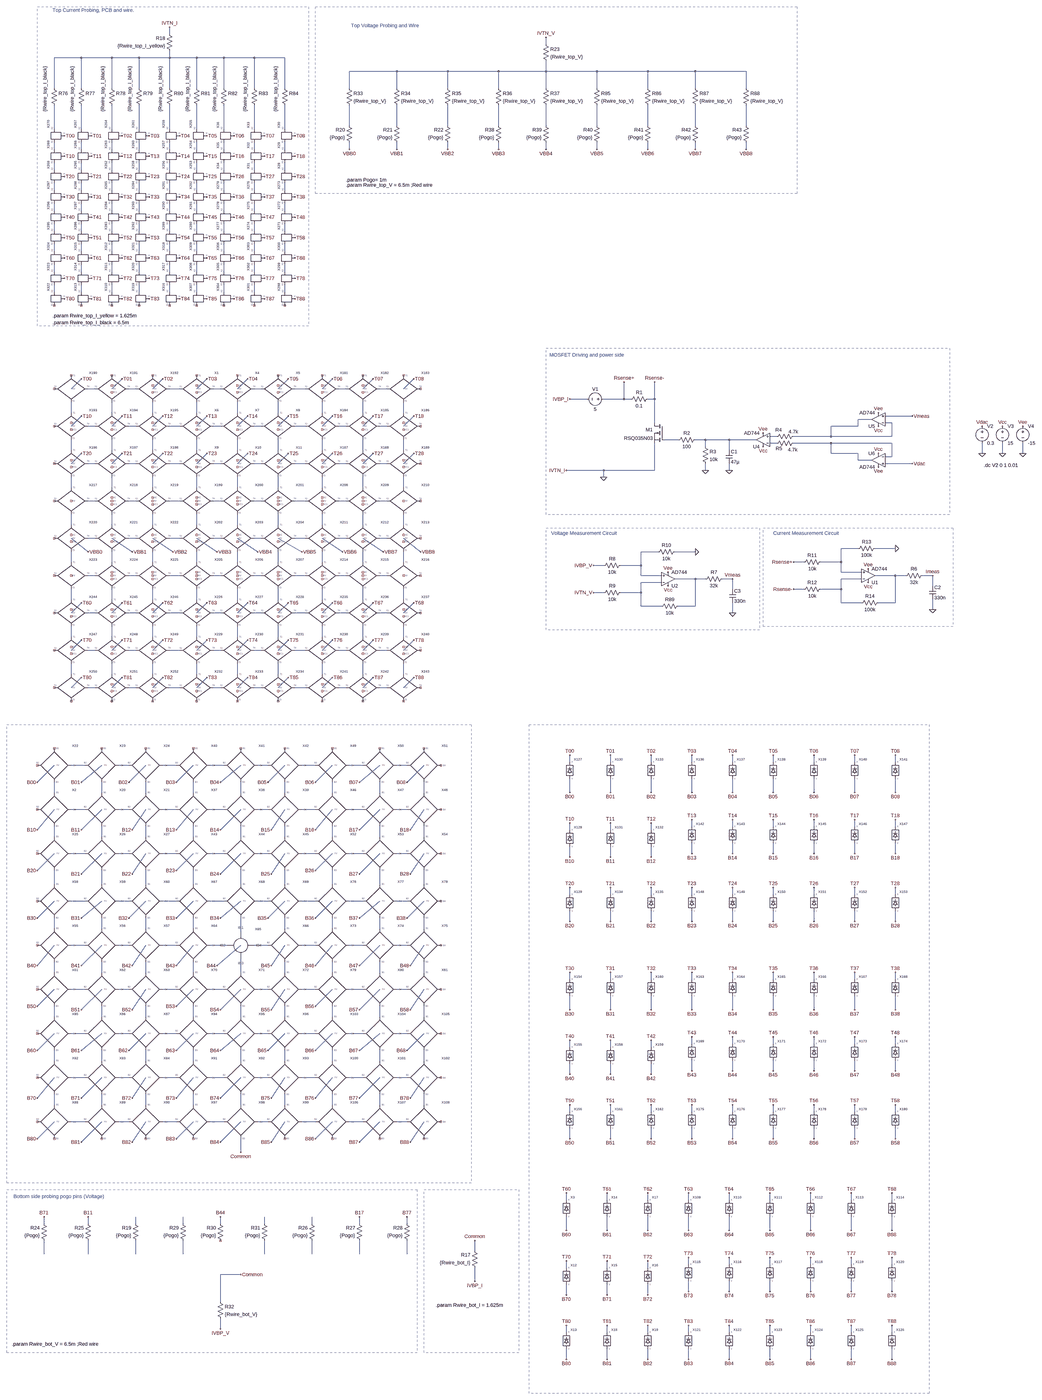
[diagram p0: schematic IVProbingV2_9x9.asc, whole sheet]
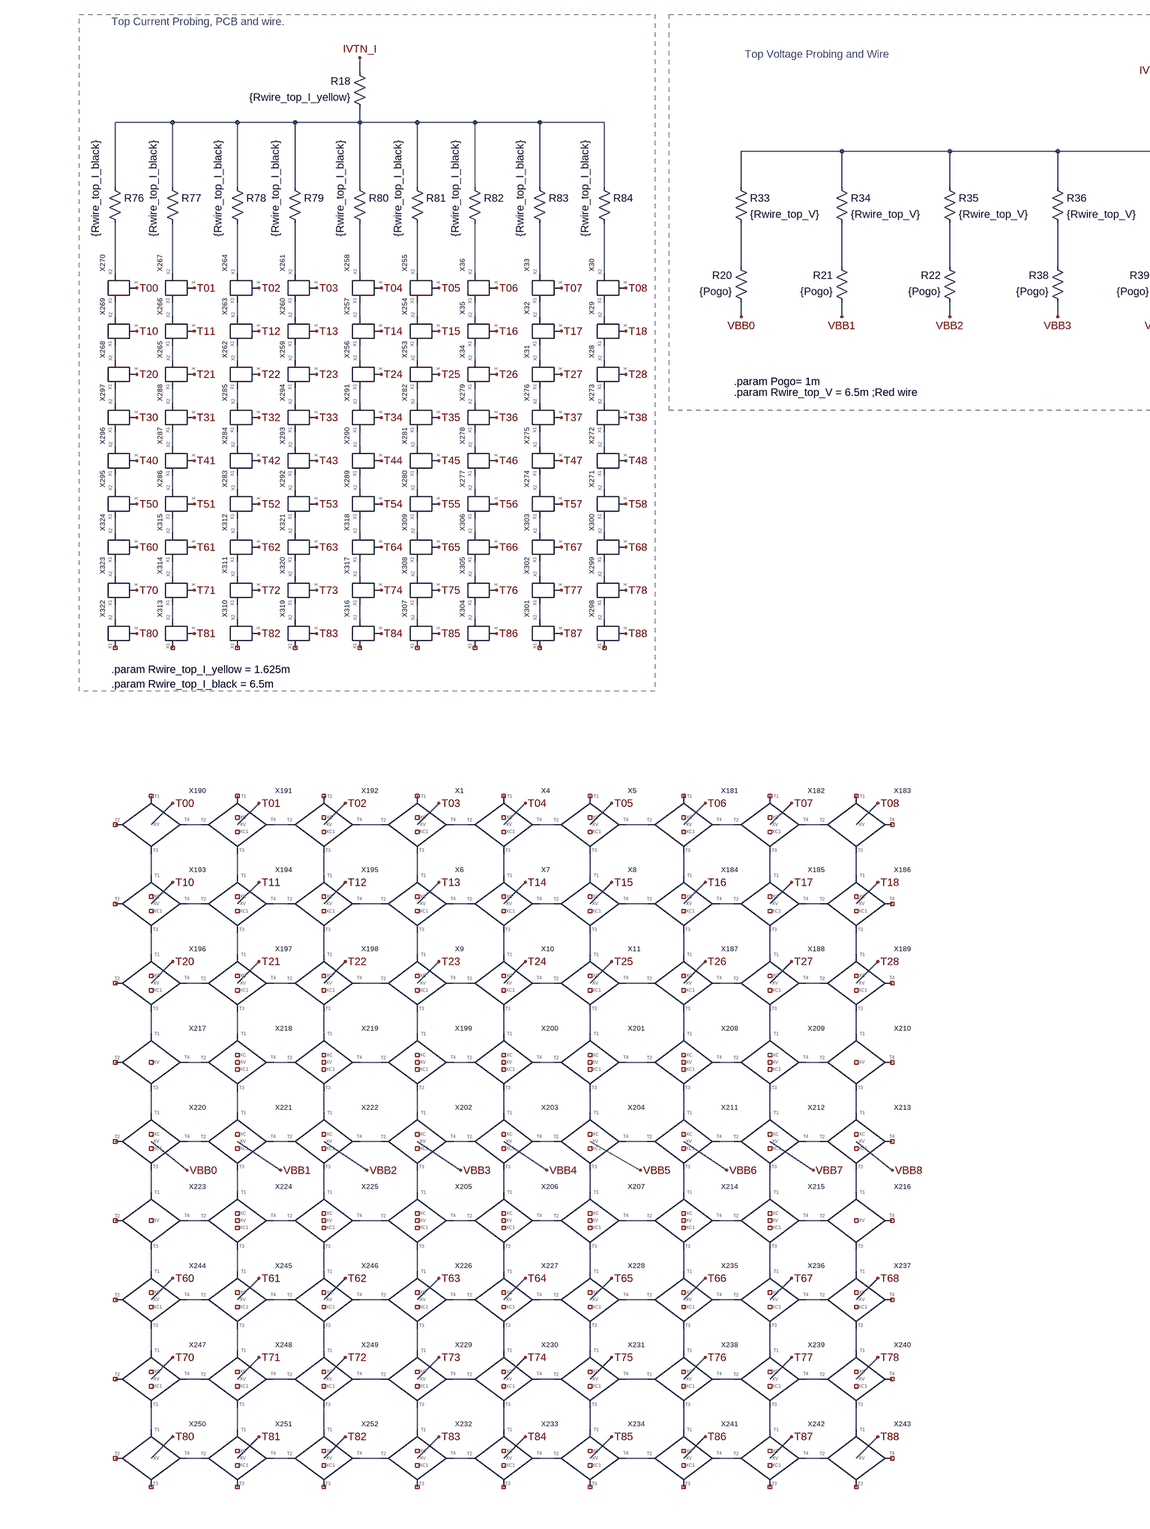
[diagram p1: schematic IVProbingV2_9x9.asc, part, row 1 of 2, column 1 of 2]
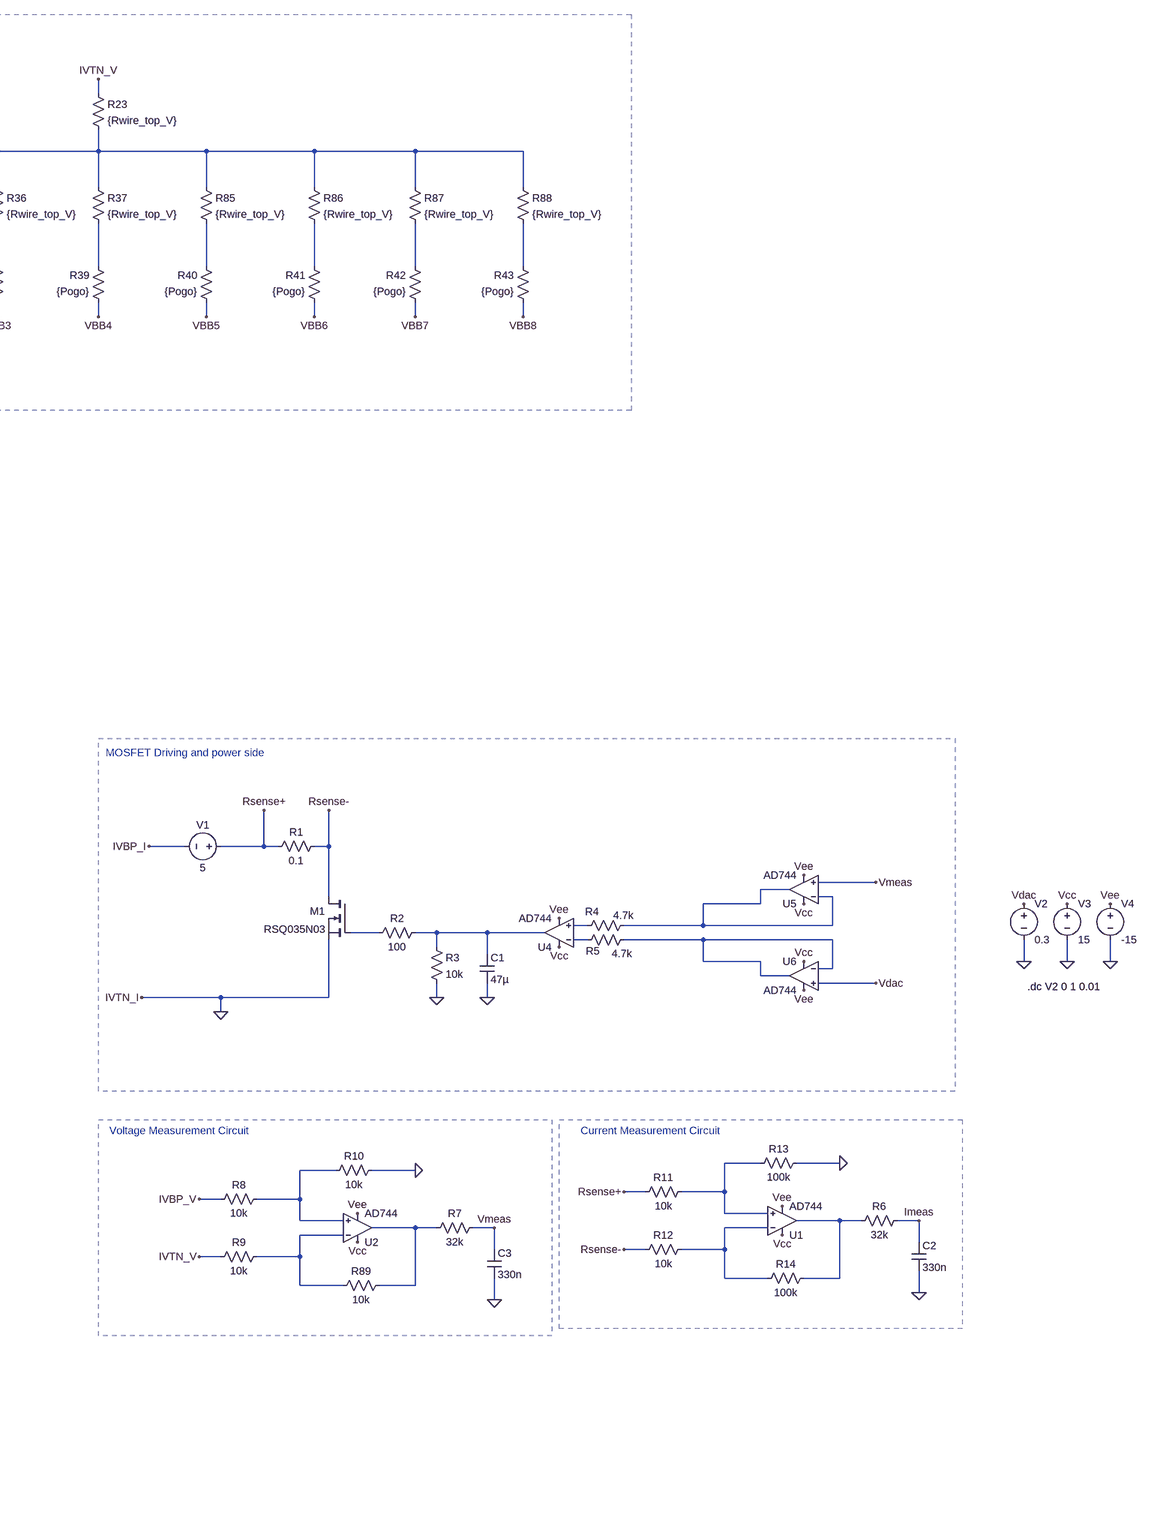
[diagram p2: schematic IVProbingV2_9x9.asc, part, row 1 of 2, column 2 of 2]
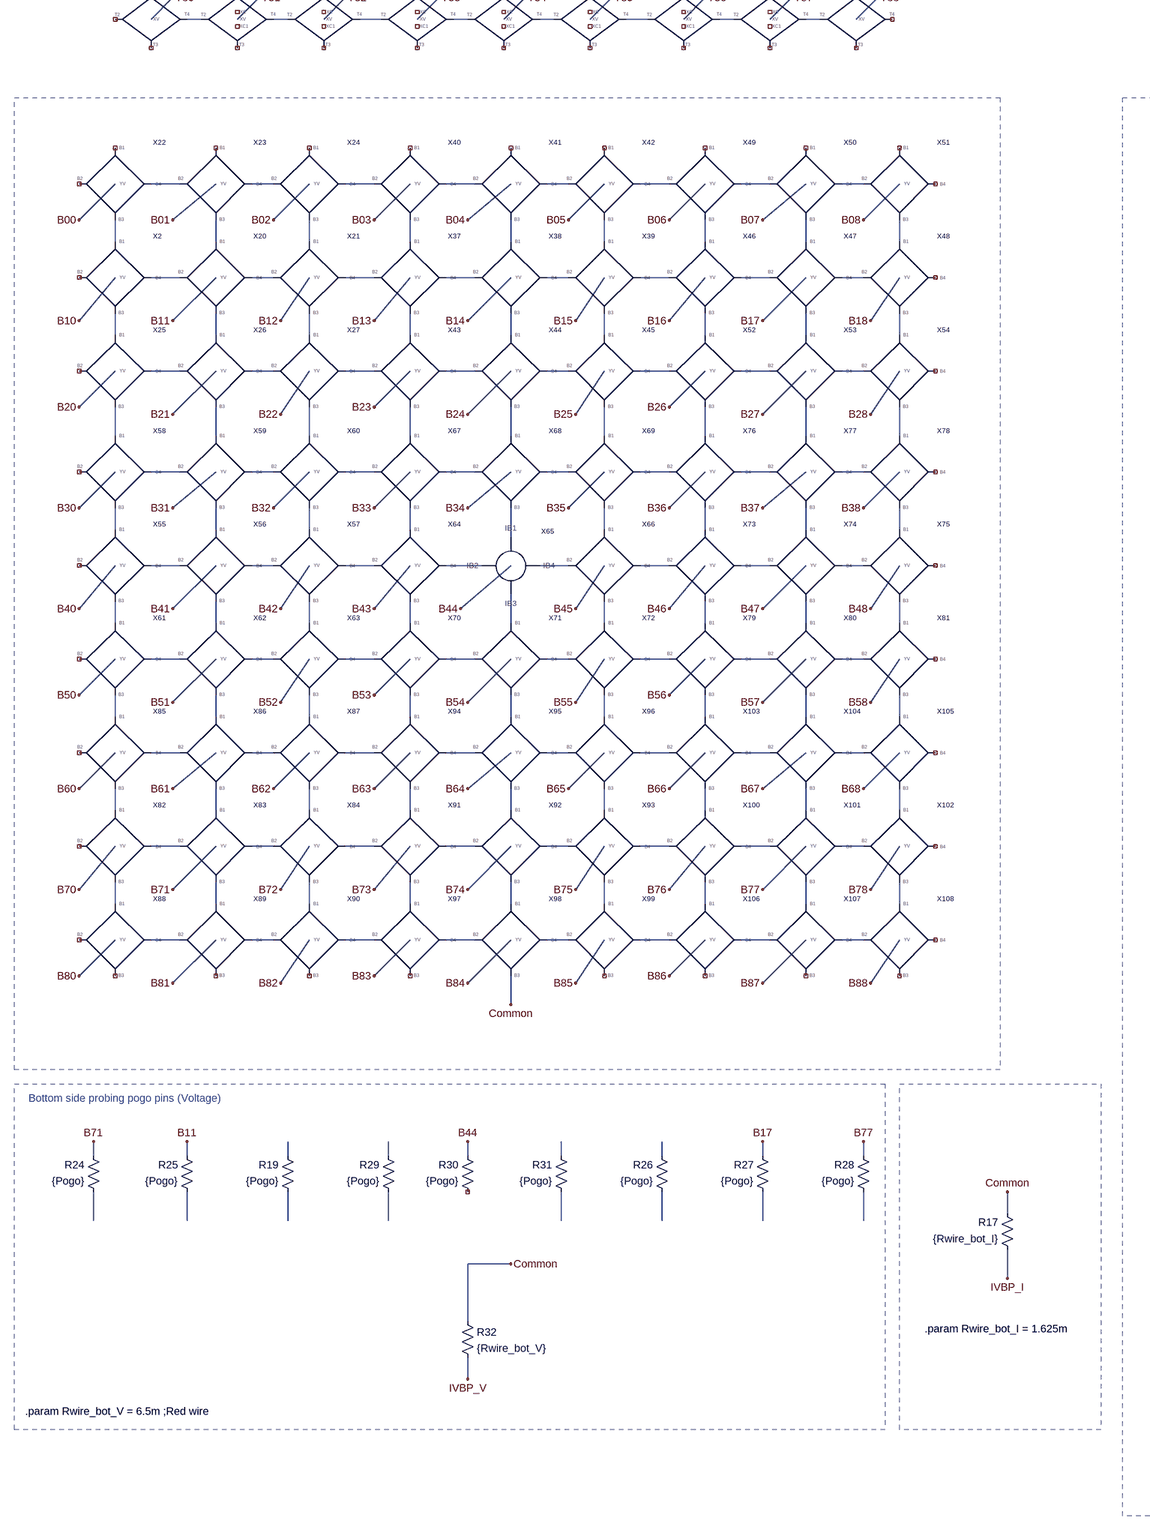
[diagram p3: schematic IVProbingV2_9x9.asc, part, row 2 of 2, column 1 of 2]
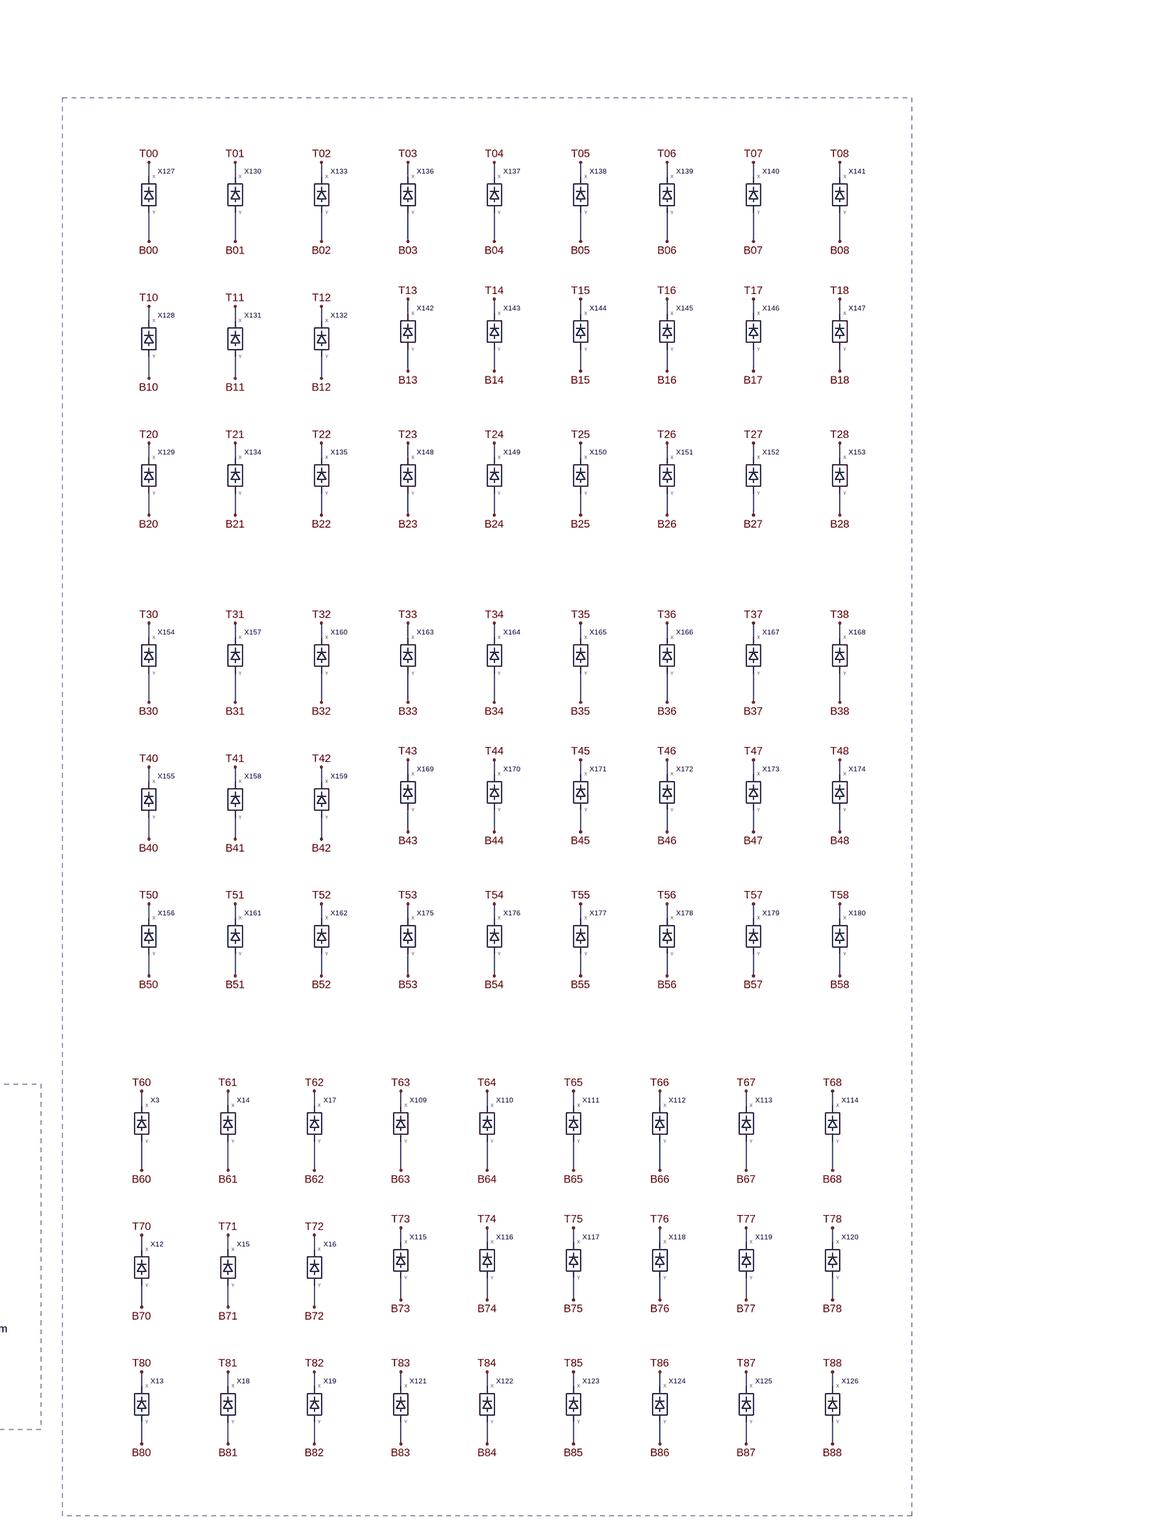
[diagram p4: schematic IVProbingV2_9x9.asc, part, row 2 of 2, column 2 of 2]
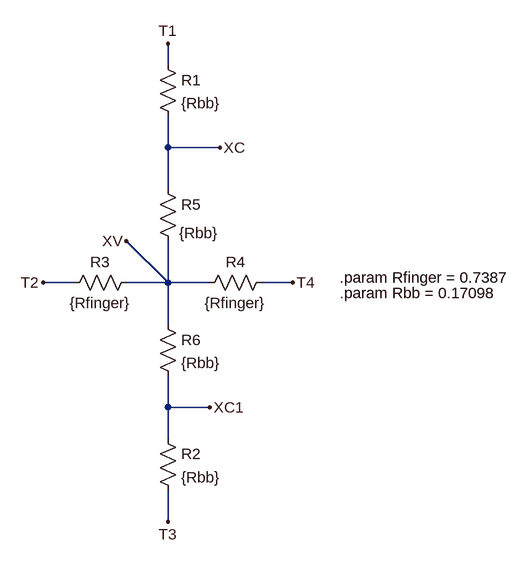
[diagram p5: sub-circuit ivtopelement.asc]
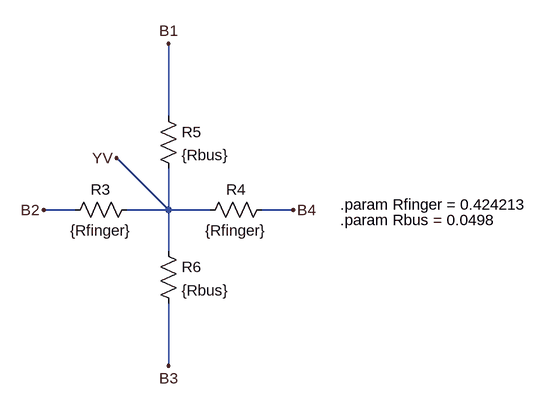
[diagram p6: sub-circuit ivbottomelement.asc]
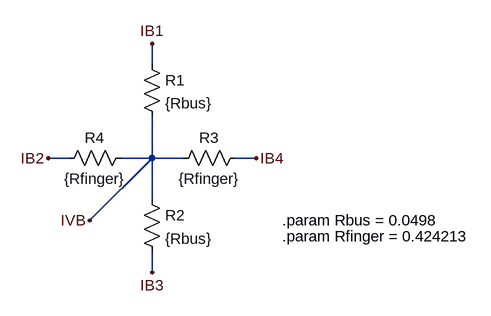
[diagram p7: sub-circuit ivbottomelementiso.asc]
* IVProbingV2_9x9.asc
XX1 T03 NC_01 NC_02 NC_03 N095 N104 N096 ivtopelement
XX2 N257 NC_04 N274 N266 B10 ivbottomelement
XX3 T60 B60 IVCellModel  ; pins X Y
R1 Rsense- Rsense+ 0.1
V1 Rsense+ IVBP_I 5
R2 N121 N120 100
R3 N121 0 10k
C1 N121 0 47µ
R4 N110 N119 4.7k
R5 N123 N122 4.7k
V2 Vdac 0 0.3
V3 Vcc 0 15
V4 Vee 0 -15
R6 Imeas N194 32k
C2 Imeas 0 330n
R11 N175 Rsense+ 10k
R12 N196 Rsense- 10k
R13 0 N175 100k
R14 N194 N196 100k
XU1 N175 N196 Vcc Vee N194 AD744  ; pins In+ In- V+ V- OUT
XU4 N119 N122 Vcc Vee N121 AD744  ; pins In+ In- V+ V- OUT
XU5 Vmeas N110 Vcc Vee N110 AD744  ; pins In+ In- V+ V- OUT
XU6 Vdac N123 Vcc Vee N123 AD744  ; pins In+ In- V+ V- OUT
XX4 T04 NC_05 NC_06 NC_07 N096 N105 N097 ivtopelement
XX5 T05 NC_08 NC_09 NC_10 N097 N106 N098 ivtopelement
XX6 T13 NC_11 NC_12 N104 N113 N127 N114 ivtopelement
XX7 T14 NC_13 NC_14 N105 N114 N128 N115 ivtopelement
XX8 T15 NC_15 NC_16 N106 N115 N129 N116 ivtopelement
XX9 T23 NC_17 NC_18 N127 N135 N144 N136 ivtopelement
XX10 T24 NC_19 NC_20 N128 N136 N145 N137 ivtopelement
XX11 T25 NC_21 NC_22 N129 N137 N146 N138 ivtopelement
XX12 T70 B70 IVCellModel  ; pins X Y
XX13 T80 B80 IVCellModel  ; pins X Y
XX14 T61 B61 IVCellModel  ; pins X Y
XX15 T71 B71 IVCellModel  ; pins X Y
XX16 T72 B72 IVCellModel  ; pins X Y
XX17 T62 B62 IVCellModel  ; pins X Y
XX18 T81 B81 IVCellModel  ; pins X Y
XX19 T82 B82 IVCellModel  ; pins X Y
XX20 N258 N266 N275 N267 B11 ivbottomelement
XX21 N259 N267 N276 N268 B12 ivbottomelement
XX22 NC_23 NC_24 N257 N249 B00 ivbottomelement
XX23 NC_25 N249 N258 N250 B01 ivbottomelement
XX24 NC_26 N250 N259 N251 B02 ivbottomelement
XX25 N274 NC_27 N291 N283 B20 ivbottomelement
XX26 N275 N283 N292 N284 B21 ivbottomelement
XX27 N276 N284 N293 N285 B22 ivbottomelement
R17 IVBP_I Common {Rwire_bot_I}
XX28 T28 N047 N038 IVProbingPCB  ; pins X X1 X2
XX29 T18 N038 N029 IVProbingPCB  ; pins X X1 X2
XX30 T08 N029 N020 IVProbingPCB  ; pins X X1 X2
XX31 T27 N046 N037 IVProbingPCB  ; pins X X1 X2
XX32 T17 N037 N028 IVProbingPCB  ; pins X X1 X2
XX33 T07 N028 N019 IVProbingPCB  ; pins X X1 X2
XX34 T26 N045 N036 IVProbingPCB  ; pins X X1 X2
XX35 T16 N036 N027 IVProbingPCB  ; pins X X1 X2
XX36 T06 N027 N018 IVProbingPCB  ; pins X X1 X2
R18 N001 0 {Rwire_top_I_yellow}
R19 N399 N393 {Pogo}
R20 VBB0 N003 {Pogo}
R21 VBB1 N004 {Pogo}
R22 VBB2 N005 {Pogo}
R23 IVTN_V N002 {Rwire_top_V}
R24 N397 B71 {Pogo}
R25 N398 B11 {Pogo}
R26 N402 N396 {Pogo}
R27 N403 B17 {Pogo}
R28 N404 B77 {Pogo}
R29 N400 N394 {Pogo}
R30 NC_28 B44 {Pogo}
R31 N401 N395 {Pogo}
R32 Common IVBP_V {Rwire_bot_V}
XX37 N260 N268 N277 N269 B13 ivbottomelement
XX38 N261 N269 N278 N270 B14 ivbottomelement
XX39 N262 N270 N279 N271 B15 ivbottomelement
XX40 NC_29 N251 N260 N252 B03 ivbottomelement
XX41 NC_30 N252 N261 N253 B04 ivbottomelement
XX42 NC_31 N253 N262 N254 B05 ivbottomelement
XX43 N277 N285 N294 N286 B23 ivbottomelement
XX44 N278 N286 N295 N287 B24 ivbottomelement
XX45 N279 N287 N296 N288 B25 ivbottomelement
XX46 N263 N271 N280 N272 B16 ivbottomelement
XX47 N264 N272 N281 N273 B17 ivbottomelement
XX48 N265 N273 N282 NC_32 B18 ivbottomelement
XX49 NC_33 N254 N263 N255 B06 ivbottomelement
XX50 NC_34 N255 N264 N256 B07 ivbottomelement
XX51 NC_35 N256 N265 NC_36 B08 ivbottomelement
XX52 N280 N288 N297 N289 B26 ivbottomelement
XX53 N281 N289 N298 N290 B27 ivbottomelement
XX54 N282 N290 N299 NC_37 B28 ivbottomelement
XX55 N308 NC_38 N325 N317 B40 ivbottomelement
XX56 N309 N317 N326 N318 B41 ivbottomelement
XX57 N310 N318 N327 N319 B42 ivbottomelement
XX58 N291 NC_39 N308 N300 B30 ivbottomelement
XX59 N292 N300 N309 N301 B31 ivbottomelement
XX60 N293 N301 N310 N302 B32 ivbottomelement
XX61 N325 NC_40 N342 N334 B50 ivbottomelement
XX62 N326 N334 N343 N335 B51 ivbottomelement
XX63 N327 N335 N344 N336 B52 ivbottomelement
XX64 N311 N319 N328 N320 B43 ivbottomelement
XX66 N312 N321 N330 N322 B45 ivbottomelement
XX67 N294 N302 N311 N303 B33 ivbottomelement
XX68 N295 N303 N316 N304 B34 ivbottomelement
XX69 N296 N304 N312 N305 B35 ivbottomelement
XX70 N328 N336 N345 N337 B53 ivbottomelement
XX71 N329 N337 N346 N338 B54 ivbottomelement
XX72 N330 N338 N347 N339 B55 ivbottomelement
XX73 N313 N322 N331 N323 B46 ivbottomelement
XX74 N314 N323 N332 N324 B47 ivbottomelement
XX75 N315 N324 N333 NC_41 B48 ivbottomelement
XX76 N297 N305 N313 N306 B36 ivbottomelement
XX77 N298 N306 N314 N307 B37 ivbottomelement
XX78 N299 N307 N315 NC_42 B38 ivbottomelement
XX79 N331 N339 N348 N340 B56 ivbottomelement
XX80 N332 N340 N349 N341 B57 ivbottomelement
XX81 N333 N341 N350 NC_43 B58 ivbottomelement
XX82 N359 NC_44 N376 N368 B70 ivbottomelement
XX83 N360 N368 N377 N369 B71 ivbottomelement
XX84 N361 N369 N378 N370 B72 ivbottomelement
XX85 N342 NC_45 N359 N351 B60 ivbottomelement
XX86 N343 N351 N360 N352 B61 ivbottomelement
XX87 N344 N352 N361 N353 B62 ivbottomelement
XX88 N376 NC_46 NC_47 N385 B80 ivbottomelement
XX89 N377 N385 NC_48 N386 B81 ivbottomelement
XX90 N378 N386 NC_49 N387 B82 ivbottomelement
XX91 N362 N370 N379 N371 B73 ivbottomelement
XX92 N363 N371 N380 N372 B74 ivbottomelement
XX93 N364 N372 N381 N373 B75 ivbottomelement
XX94 N345 N353 N362 N354 B63 ivbottomelement
XX95 N346 N354 N363 N355 B64 ivbottomelement
XX96 N347 N355 N364 N356 B65 ivbottomelement
XX97 N379 N387 NC_50 N388 B83 ivbottomelement
XX98 N380 N388 Common N389 B84 ivbottomelement
XX99 N381 N389 NC_51 N390 B85 ivbottomelement
XX100 N365 N373 N382 N374 B76 ivbottomelement
XX101 N366 N374 N383 N375 B77 ivbottomelement
XX102 N367 N375 N384 NC_52 B78 ivbottomelement
XX103 N348 N356 N365 N357 B66 ivbottomelement
XX104 N349 N357 N366 N358 B67 ivbottomelement
XX105 N350 N358 N367 NC_53 B68 ivbottomelement
XX106 N382 N390 NC_54 N391 B86 ivbottomelement
XX107 N383 N391 NC_55 N392 B87 ivbottomelement
XX108 N384 N392 NC_56 NC_57 B88 ivbottomelement
XX109 T63 B63 IVCellModel  ; pins X Y
XX110 T64 B64 IVCellModel  ; pins X Y
XX111 T65 B65 IVCellModel  ; pins X Y
XX112 T66 B66 IVCellModel  ; pins X Y
XX113 T67 B67 IVCellModel  ; pins X Y
XX114 T68 B68 IVCellModel  ; pins X Y
XX115 T73 B73 IVCellModel  ; pins X Y
XX116 T74 B74 IVCellModel  ; pins X Y
XX117 T75 B75 IVCellModel  ; pins X Y
XX118 T76 B76 IVCellModel  ; pins X Y
XX119 T77 B77 IVCellModel  ; pins X Y
XX120 T78 B78 IVCellModel  ; pins X Y
XX121 T83 B83 IVCellModel  ; pins X Y
XX122 T84 B84 IVCellModel  ; pins X Y
XX123 T85 B85 IVCellModel  ; pins X Y
XX124 T86 B86 IVCellModel  ; pins X Y
XX125 T87 B87 IVCellModel  ; pins X Y
XX126 T88 B88 IVCellModel  ; pins X Y
XX127 T00 B00 IVCellModel  ; pins X Y
XX128 T10 B10 IVCellModel  ; pins X Y
XX129 T20 B20 IVCellModel  ; pins X Y
XX130 T01 B01 IVCellModel  ; pins X Y
XX131 T11 B11 IVCellModel  ; pins X Y
XX132 T12 B12 IVCellModel  ; pins X Y
XX133 T02 B02 IVCellModel  ; pins X Y
XX134 T21 B21 IVCellModel  ; pins X Y
XX135 T22 B22 IVCellModel  ; pins X Y
XX136 T03 B03 IVCellModel  ; pins X Y
XX137 T04 B04 IVCellModel  ; pins X Y
XX138 T05 B05 IVCellModel  ; pins X Y
XX139 T06 B06 IVCellModel  ; pins X Y
XX140 T07 B07 IVCellModel  ; pins X Y
XX141 T08 B08 IVCellModel  ; pins X Y
XX142 T13 B13 IVCellModel  ; pins X Y
XX143 T14 B14 IVCellModel  ; pins X Y
XX144 T15 B15 IVCellModel  ; pins X Y
XX145 T16 B16 IVCellModel  ; pins X Y
XX146 T17 B17 IVCellModel  ; pins X Y
XX147 T18 B18 IVCellModel  ; pins X Y
XX148 T23 B23 IVCellModel  ; pins X Y
XX149 T24 B24 IVCellModel  ; pins X Y
XX150 T25 B25 IVCellModel  ; pins X Y
XX151 T26 B26 IVCellModel  ; pins X Y
XX152 T27 B27 IVCellModel  ; pins X Y
XX153 T28 B28 IVCellModel  ; pins X Y
XX154 T30 B30 IVCellModel  ; pins X Y
XX155 T40 B40 IVCellModel  ; pins X Y
XX156 T50 B50 IVCellModel  ; pins X Y
XX157 T31 B31 IVCellModel  ; pins X Y
XX158 T41 B41 IVCellModel  ; pins X Y
XX159 T42 B42 IVCellModel  ; pins X Y
XX160 T32 B32 IVCellModel  ; pins X Y
XX161 T51 B51 IVCellModel  ; pins X Y
XX162 T52 B52 IVCellModel  ; pins X Y
XX163 T33 B33 IVCellModel  ; pins X Y
XX164 T34 B34 IVCellModel  ; pins X Y
XX165 T35 B35 IVCellModel  ; pins X Y
XX166 T36 B36 IVCellModel  ; pins X Y
XX167 T37 B37 IVCellModel  ; pins X Y
XX168 T38 B38 IVCellModel  ; pins X Y
XX169 T43 B43 IVCellModel  ; pins X Y
XX170 T44 B44 IVCellModel  ; pins X Y
XX171 T45 B45 IVCellModel  ; pins X Y
XX172 T46 B46 IVCellModel  ; pins X Y
XX173 T47 B47 IVCellModel  ; pins X Y
XX174 T48 B48 IVCellModel  ; pins X Y
XX175 T53 B53 IVCellModel  ; pins X Y
XX176 T54 B54 IVCellModel  ; pins X Y
XX177 T55 B55 IVCellModel  ; pins X Y
XX178 T56 B56 IVCellModel  ; pins X Y
XX179 T57 B57 IVCellModel  ; pins X Y
XX180 T58 B58 IVCellModel  ; pins X Y
XX181 T06 NC_58 NC_59 NC_60 N098 N107 N099 ivtopelement
XX182 T07 NC_61 NC_62 NC_63 N099 N108 N100 ivtopelement
XX183 T08 NC_64 N100 N109 NC_65 ivtopelement
XX184 T16 NC_66 NC_67 N107 N116 N130 N117 ivtopelement
XX185 T17 NC_68 NC_69 N108 N117 N131 N118 ivtopelement
XX186 T18 NC_70 NC_71 N109 N118 N132 NC_72 ivtopelement
XX187 T26 NC_73 NC_74 N130 N138 N147 N139 ivtopelement
XX188 T27 NC_75 NC_76 N131 N139 N148 N140 ivtopelement
XX189 T28 NC_77 NC_78 N132 N140 N149 NC_79 ivtopelement
XX190 T00 NC_80 NC_81 N101 N093 ivtopelement
XX191 T01 NC_82 NC_83 NC_84 N093 N102 N094 ivtopelement
XX192 T02 NC_85 NC_86 NC_87 N094 N103 N095 ivtopelement
XX193 T10 NC_88 NC_89 N101 NC_90 N124 N111 ivtopelement
XX194 T11 NC_91 NC_92 N102 N111 N125 N112 ivtopelement
XX195 T12 NC_93 NC_94 N103 N112 N126 N113 ivtopelement
XX196 T20 NC_95 NC_96 N124 NC_97 N141 N133 ivtopelement
XX197 T21 NC_98 NC_99 N125 N133 N142 N134 ivtopelement
XX198 T22 NC_100 NC_101 N126 N134 N143 N135 ivtopelement
XX199 NC_102 NC_103 NC_104 N144 N152 N161 N153 ivtopelement
XX200 NC_105 NC_106 NC_107 N145 N153 N162 N154 ivtopelement
XX201 NC_108 NC_109 NC_110 N146 N154 N163 N155 ivtopelement
XX202 VBB3 NC_111 NC_112 N161 N169 N180 N170 ivtopelement
XX203 VBB4 NC_113 NC_114 N162 N170 N181 N171 ivtopelement
XX204 VBB5 NC_115 NC_116 N163 N171 N182 N172 ivtopelement
XX205 NC_117 NC_118 NC_119 N180 N188 N201 N189 ivtopelement
XX206 NC_120 NC_121 NC_122 N181 N189 N202 N190 ivtopelement
XX207 NC_123 NC_124 NC_125 N182 N190 N203 N191 ivtopelement
XX208 NC_126 NC_127 NC_128 N147 N155 N164 N156 ivtopelement
XX209 NC_129 NC_130 NC_131 N148 N156 N165 N157 ivtopelement
XX210 NC_132 N149 N157 N166 NC_133 ivtopelement
XX211 VBB6 NC_134 NC_135 N164 N172 N183 N173 ivtopelement
XX212 VBB7 NC_136 NC_137 N165 N173 N184 N174 ivtopelement
XX213 VBB8 NC_138 NC_139 N166 N174 N185 NC_140 ivtopelement
XX214 NC_141 NC_142 NC_143 N183 N191 N204 N192 ivtopelement
XX215 NC_144 NC_145 NC_146 N184 N192 N205 N193 ivtopelement
XX216 NC_147 N185 N193 N206 NC_148 ivtopelement
XX217 NC_149 N141 NC_150 N158 N150 ivtopelement
XX218 NC_151 NC_152 NC_153 N142 N150 N159 N151 ivtopelement
XX219 NC_154 NC_155 NC_156 N143 N151 N160 N152 ivtopelement
XX220 VBB0 NC_157 NC_158 N158 NC_159 N177 N167 ivtopelement
XX221 VBB1 NC_160 NC_161 N159 N167 N178 N168 ivtopelement
XX222 VBB2 NC_162 NC_163 N160 N168 N179 N169 ivtopelement
XX223 NC_164 N177 NC_165 N198 N186 ivtopelement
XX224 NC_166 NC_167 NC_168 N178 N186 N199 N187 ivtopelement
XX225 NC_169 NC_170 NC_171 N179 N187 N200 N188 ivtopelement
XX226 T63 NC_172 NC_173 N201 N209 N218 N210 ivtopelement
XX227 T64 NC_174 NC_175 N202 N210 N219 N211 ivtopelement
XX228 T65 NC_176 NC_177 N203 N211 N220 N212 ivtopelement
XX229 T73 NC_178 NC_179 N218 N226 N235 N227 ivtopelement
XX230 T74 NC_180 NC_181 N219 N227 N236 N228 ivtopelement
XX231 T75 NC_182 NC_183 N220 N228 N237 N229 ivtopelement
XX232 T83 NC_184 NC_185 N235 N243 NC_186 N244 ivtopelement
XX233 T84 NC_187 NC_188 N236 N244 NC_189 N245 ivtopelement
XX234 T85 NC_190 NC_191 N237 N245 NC_192 N246 ivtopelement
XX235 T66 NC_193 NC_194 N204 N212 N221 N213 ivtopelement
XX236 T67 NC_195 NC_196 N205 N213 N222 N214 ivtopelement
XX237 T68 NC_197 NC_198 N206 N214 N223 NC_199 ivtopelement
XX238 T76 NC_200 NC_201 N221 N229 N238 N230 ivtopelement
XX239 T77 NC_202 NC_203 N222 N230 N239 N231 ivtopelement
XX240 T78 NC_204 NC_205 N223 N231 N240 NC_206 ivtopelement
XX241 T86 NC_207 NC_208 N238 N246 NC_209 N247 ivtopelement
XX242 T87 NC_210 NC_211 N239 N247 NC_212 N248 ivtopelement
XX243 T88 N240 N248 NC_213 NC_214 ivtopelement
XX244 T60 NC_215 NC_216 N198 NC_217 N215 N207 ivtopelement
XX245 T61 NC_218 NC_219 N199 N207 N216 N208 ivtopelement
XX246 T62 NC_220 NC_221 N200 N208 N217 N209 ivtopelement
XX247 T70 NC_222 NC_223 N215 NC_224 N232 N224 ivtopelement
XX248 T71 NC_225 NC_226 N216 N224 N233 N225 ivtopelement
XX249 T72 NC_227 NC_228 N217 N225 N234 N226 ivtopelement
XX250 T80 N232 NC_229 NC_230 N241 ivtopelement
XX251 T81 NC_231 NC_232 N233 N241 NC_233 N242 ivtopelement
XX252 T82 NC_234 NC_235 N234 N242 NC_236 N243 ivtopelement
XX253 T25 N044 N035 IVProbingPCB  ; pins X X1 X2
XX254 T15 N035 N026 IVProbingPCB  ; pins X X1 X2
XX255 T05 N026 N017 IVProbingPCB  ; pins X X1 X2
XX256 T24 N043 N034 IVProbingPCB  ; pins X X1 X2
XX257 T14 N034 N025 IVProbingPCB  ; pins X X1 X2
XX258 T04 N025 N016 IVProbingPCB  ; pins X X1 X2
XX259 T23 N042 N033 IVProbingPCB  ; pins X X1 X2
XX260 T13 N033 N024 IVProbingPCB  ; pins X X1 X2
XX261 T03 N024 N015 IVProbingPCB  ; pins X X1 X2
XX262 T22 N041 N032 IVProbingPCB  ; pins X X1 X2
XX263 T12 N032 N023 IVProbingPCB  ; pins X X1 X2
XX264 T02 N023 N014 IVProbingPCB  ; pins X X1 X2
XX265 T21 N040 N031 IVProbingPCB  ; pins X X1 X2
XX266 T11 N031 N022 IVProbingPCB  ; pins X X1 X2
XX267 T01 N022 N013 IVProbingPCB  ; pins X X1 X2
XX268 T20 N039 N030 IVProbingPCB  ; pins X X1 X2
XX269 T10 N030 N021 IVProbingPCB  ; pins X X1 X2
XX270 T00 N021 N012 IVProbingPCB  ; pins X X1 X2
XX271 T58 N074 N065 IVProbingPCB  ; pins X X1 X2
XX272 T48 N065 N056 IVProbingPCB  ; pins X X1 X2
XX273 T38 N056 N047 IVProbingPCB  ; pins X X1 X2
XX274 T57 N073 N064 IVProbingPCB  ; pins X X1 X2
XX275 T47 N064 N055 IVProbingPCB  ; pins X X1 X2
XX276 T37 N055 N046 IVProbingPCB  ; pins X X1 X2
XX277 T56 N072 N063 IVProbingPCB  ; pins X X1 X2
XX278 T46 N063 N054 IVProbingPCB  ; pins X X1 X2
XX279 T36 N054 N045 IVProbingPCB  ; pins X X1 X2
XX280 T55 N071 N062 IVProbingPCB  ; pins X X1 X2
XX281 T45 N062 N053 IVProbingPCB  ; pins X X1 X2
XX282 T35 N053 N044 IVProbingPCB  ; pins X X1 X2
XX283 T52 N068 N059 IVProbingPCB  ; pins X X1 X2
XX284 T42 N059 N050 IVProbingPCB  ; pins X X1 X2
XX285 T32 N050 N041 IVProbingPCB  ; pins X X1 X2
XX286 T51 N067 N058 IVProbingPCB  ; pins X X1 X2
XX287 T41 N058 N049 IVProbingPCB  ; pins X X1 X2
XX288 T31 N049 N040 IVProbingPCB  ; pins X X1 X2
XX289 T54 N070 N061 IVProbingPCB  ; pins X X1 X2
XX290 T44 N061 N052 IVProbingPCB  ; pins X X1 X2
XX291 T34 N052 N043 IVProbingPCB  ; pins X X1 X2
XX292 T53 N069 N060 IVProbingPCB  ; pins X X1 X2
XX293 T43 N060 N051 IVProbingPCB  ; pins X X1 X2
XX294 T33 N051 N042 IVProbingPCB  ; pins X X1 X2
XX295 T50 N066 N057 IVProbingPCB  ; pins X X1 X2
XX296 T40 N057 N048 IVProbingPCB  ; pins X X1 X2
XX297 T30 N048 N039 IVProbingPCB  ; pins X X1 X2
XX298 T88 NC_237 N092 IVProbingPCB  ; pins X X1 X2
XX299 T78 N092 N083 IVProbingPCB  ; pins X X1 X2
XX300 T68 N083 N074 IVProbingPCB  ; pins X X1 X2
XX301 T87 NC_238 N091 IVProbingPCB  ; pins X X1 X2
XX302 T77 N091 N082 IVProbingPCB  ; pins X X1 X2
XX303 T67 N082 N073 IVProbingPCB  ; pins X X1 X2
XX304 T86 NC_239 N090 IVProbingPCB  ; pins X X1 X2
XX305 T76 N090 N081 IVProbingPCB  ; pins X X1 X2
XX306 T66 N081 N072 IVProbingPCB  ; pins X X1 X2
XX307 T85 NC_240 N089 IVProbingPCB  ; pins X X1 X2
XX308 T75 N089 N080 IVProbingPCB  ; pins X X1 X2
XX309 T65 N080 N071 IVProbingPCB  ; pins X X1 X2
XX310 T82 NC_241 N086 IVProbingPCB  ; pins X X1 X2
XX311 T72 N086 N077 IVProbingPCB  ; pins X X1 X2
XX312 T62 N077 N068 IVProbingPCB  ; pins X X1 X2
XX313 T81 NC_242 N085 IVProbingPCB  ; pins X X1 X2
XX314 T71 N085 N076 IVProbingPCB  ; pins X X1 X2
XX315 T61 N076 N067 IVProbingPCB  ; pins X X1 X2
XX316 T84 NC_243 N088 IVProbingPCB  ; pins X X1 X2
XX317 T74 N088 N079 IVProbingPCB  ; pins X X1 X2
XX318 T64 N079 N070 IVProbingPCB  ; pins X X1 X2
XX319 T83 NC_244 N087 IVProbingPCB  ; pins X X1 X2
XX320 T73 N087 N078 IVProbingPCB  ; pins X X1 X2
XX321 T63 N078 N069 IVProbingPCB  ; pins X X1 X2
XX322 T80 NC_245 N084 IVProbingPCB  ; pins X X1 X2
XX323 T70 N084 N075 IVProbingPCB  ; pins X X1 X2
XX324 T60 N075 N066 IVProbingPCB  ; pins X X1 X2
R38 VBB3 N006 {Pogo}
R39 VBB4 N007 {Pogo}
R40 VBB5 N008 {Pogo}
R41 VBB6 N009 {Pogo}
R42 VBB7 N010 {Pogo}
R43 VBB8 N011 {Pogo}
R76 N001 N012 {Rwire_top_I_black}
R77 N001 N013 {Rwire_top_I_black}
R78 N001 N014 {Rwire_top_I_black}
R79 N001 N015 {Rwire_top_I_black}
R80 N001 N016 {Rwire_top_I_black}
R81 N001 N017 {Rwire_top_I_black}
R82 N001 N018 {Rwire_top_I_black}
R83 N001 N019 {Rwire_top_I_black}
R84 N001 N020 {Rwire_top_I_black}
R33 N002 N003 {Rwire_top_V}
R34 N002 N004 {Rwire_top_V}
R35 N002 N005 {Rwire_top_V}
R36 N002 N006 {Rwire_top_V}
R37 N002 N007 {Rwire_top_V}
R85 N002 N008 {Rwire_top_V}
R86 N002 N009 {Rwire_top_V}
R87 N002 N010 {Rwire_top_V}
R88 N002 N011 {Rwire_top_V}
M1 Rsense- N120 0 0 RSQ035N03
R7 Vmeas N195 32k
C3 Vmeas 0 330n
R8 N176 IVBP_V 10k
R9 N197 IVTN_V 10k
R10 0 N176 10k
R89 N195 N197 10k
XU2 N176 N197 Vcc Vee N195 AD744  ; pins In+ In- V+ V- OUT
XX65 N316 N320 N329 N321 B44 ivbottomelementiso

* block symbol definitions
.subckt ivtopelement XV XC XC1 T1 T2 T3 T4
R1 T1 XC {Rbb}
R2 XC1 T3 {Rbb}
R3 XV T2 {Rfinger}
R4 T4 XV {Rfinger}
R5 XC XV {Rbb}
R6 XV XC1 {Rbb}
.param Rfinger = 0.7387
.param Rbb = 0.17098
.ends ivtopelement

.subckt ivbottomelement B1 B2 B3 B4 YV
R3 YV B2 {Rfinger}
R4 B4 YV {Rfinger}
R5 B1 YV {Rbus}
R6 YV B3 {Rbus}
.param Rfinger = 0.424213
.param Rbus = 0.0498
.ends ivbottomelement

.subckt ivbottomelementiso IB1 IB2 IB3 IB4 IVB
R1 IB1 IVB {Rbus}
R2 IVB IB3 {Rbus}
R3 IB4 IVB {Rfinger}
R4 IVB IB2 {Rfinger}
.param Rbus = 0.0498
.param Rfinger = 0.424213
.ends ivbottomelementiso

.model NMOS NMOS
.model PMOS PMOS
.lib standard.mos
.dc V2 0 1 0.01
* Voltage Measurement Circuit
* Current Measurement Circuit
* MOSFET Driving and power side
.param Rwire_bot_I = 1.625m
.param Rwire_top_I_yellow = 1.625m
* Top Current Probing, PCB and wire.
.param Rwire_top_V = 6.5m ;Red wire
.param Rwire_bot_V = 6.5m ;Red wire
.param Pogo= 1m
* Top Voltage Probing and Wire
* Bottom side probing pogo pins (Voltage)
.param Rwire_top_I_black = 6.5m
.backanno
.end